# EAGLE design usbDirectController3 (EAGLE 9.4.2)
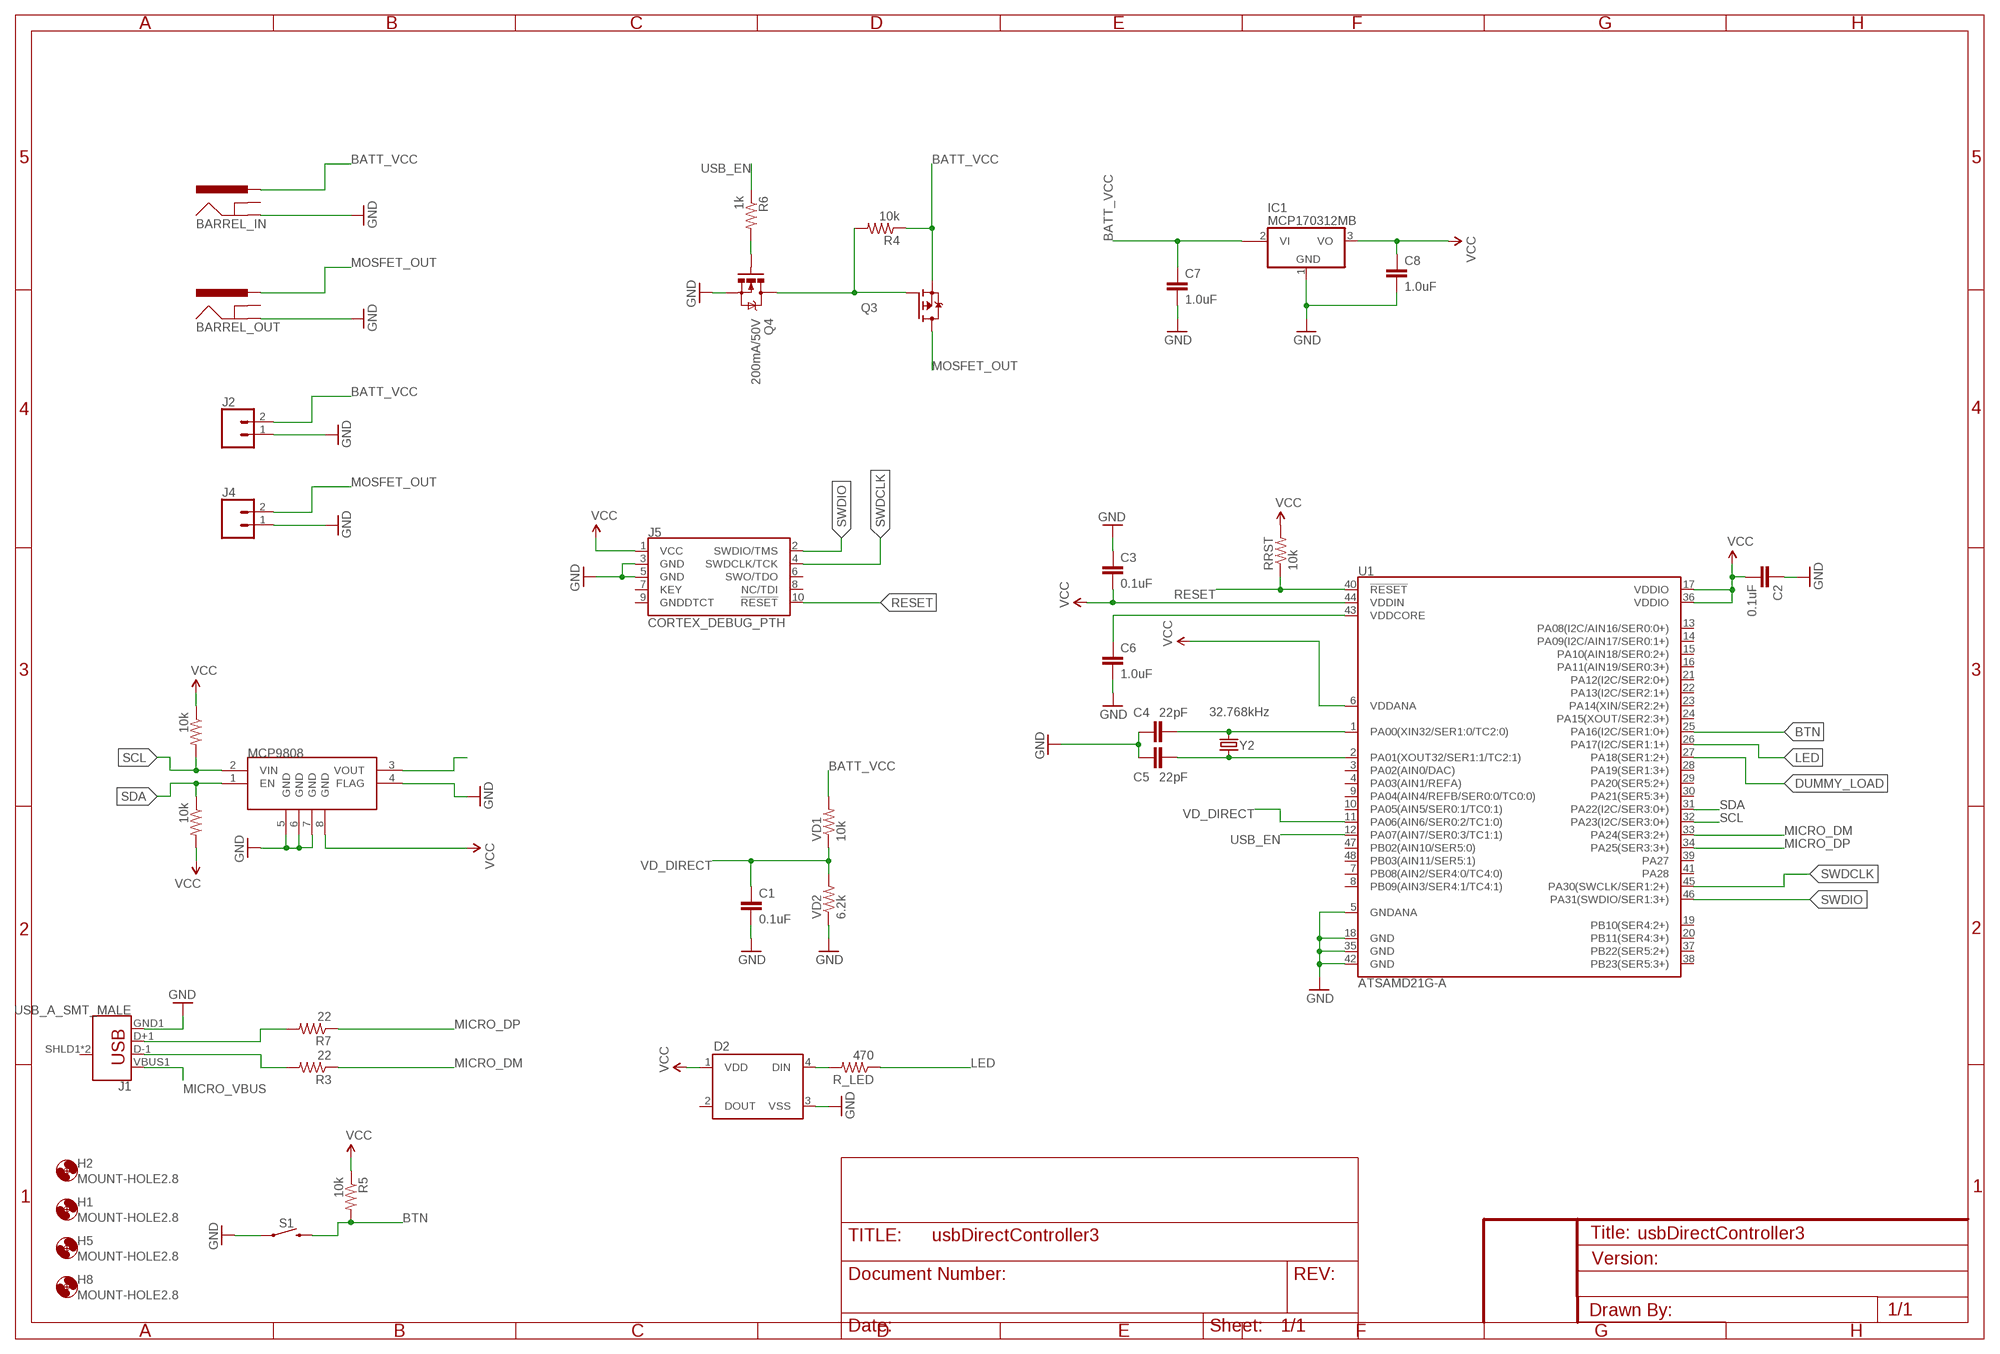
[diagram p0: schematic, sheet 1]

## Parts
BARREL_IN  POWER_JACKPTH_BREAD  [POWER_JACK_PTH_BREAD]
BARREL_OUT  POWER_JACKPTH_BREAD  [POWER_JACK_PTH_BREAD]
C1  0.1uF  CAP0805  [0805]
C2  0.1uF  1.0UF-0805-25V-10%  [0805]
C3  0.1uF  1.0UF-0805-25V-10%  [0805]
C4  22pF  CAP0805  [0805]
C5  22pF  CAP0805  [0805]
C6  1.0uF  1.0UF-0805-25V-10%  [0805]
C7  1.0uF  1.0UF-0805-25V-10%  [0805]
C8  1.0uF  1.0UF-0805-25V-10%  [0805]
D2  WS2812B  [WS2812B]
H1  MOUNT-HOLE2.8  [2,8]
H2  MOUNT-HOLE2.8  [2,8]
H5  MOUNT-HOLE2.8  [2,8]
H8  MOUNT-HOLE2.8  [2,8]
IC1  MCP170312MB  [SOT89]
J1  USB_A_SMT_MALE  [USB-A-SMT-MALE]
J2  CONN_025MM  [SCREWTERMINAL-5MM-2]
J4  CONN_025MM  [SCREWTERMINAL-5MM-2]
J5  CORTEX_DEBUG_PTH  [2X5-PTH-1.27MM]
MCP9808  V_REG_MIC5216  [MSOP8]
Q3  FDD4141TO252  [TO252]
Q4  200mA/50V  MOSFET-NCHANNELBSS138  [SOT23-3]
R3  22  RESISTOR0805-RES  [0805]
R4  10k  RESISTOR0805-RES  [0805]
R5  10k  RESISTOR0805-RES  [0805]
R6  1k  RESISTOR0805-RES  [0805]
R7  22  RESISTOR0805-RES  [0805]
R_I2C_1  10k  RESISTOR0805-RES  [0805]
R_I2C_2  10k  RESISTOR0805-RES  [0805]
R_LED  470  RESISTOR0805-RES  [0805]
RRST  10k  RESISTOR0805-RES  [0805]
S1  MOMENTARY-SWITCH-SPST-SMD-5.2MM  [TACTILE_SWITCH_SMD_5.2MM]
U1  ATSAMD21G-A  [TQFP-48]
VD1  10k  RESISTOR0805-RES  [0805]
VD2  6.2k  RESISTOR0805-RES  [0805]
Y2  32.768kHz  CRYSTAL3.2X1.5MM  [CRYSTAL-SMD-3.2X1.5MM]

## Nets
BATT_VCC: BARREL_IN.PWR C7.1 IC1.2@1(VI1) J2.2 Q3.2(S) R4.1 VD1.2
BTN: R5.2 S1.3 U1.25(PA16(I2C/SER1:0+))
DUMMY_LOAD: U1.27(PA18(SER1:2+))
GND: BARREL_IN.GND BARREL_OUT.GND C1.2 C2.1 C3.1 C4.1 C5.1 C6.2 C7.2 C8.2 D2.3(VSS) IC1.1(GND) J1.GND1(GND) J2.1 J4.1 J5.3(GND) J5.5(GND) MCP9808.4(FLAG) MCP9808.5(GND) MCP9808.6(GND) MCP9808.7(GND) Q4.2(S) S1.1 U1.5(GNDANA) U1.18(GND) U1.35(GND) U1.42(GND) VD2.1
LED: R_LED.1 U1.26(PA17(I2C/SER1:1+))
MICRO_DM: R3.1 U1.33(PA24(SER3:2+))
MICRO_DP: R7.1 U1.34(PA25(SER3:3+))
MICRO_VBUS: J1.VBUS1(VBUS)
MOSFET_OUT [power]: BARREL_OUT.PWR J4.2 Q3.3(D)
N$1: C6.1 U1.43(VDDCORE)
N$2: Q4.1(G) R6.2
N$3: Q3.1(G) Q4.3(D) R4.2
N$4: MCP9808.3(VOUT)
N$5: J1.D+1(D+) R7.2
N$6: J1.D-1(D-) R3.2
N$7: D2.4(DIN) R_LED.2
N$8: C4.2 U1.1(PA00(XIN32/SER1:0/TC2:0)) Y2.P$2
N$32: C5.2 U1.2(PA01(XOUT32/SER1:1/TC2:1)) Y2.P$1
RESET: J5.10(!RESET) RRST.1 U1.40(!RESET!)
SCL: MCP9808.2(VIN) R_I2C_1.2 U1.32(PA23(I2C/SER3:0+))
SDA: MCP9808.1(EN) R_I2C_2.1 U1.31(PA22(I2C/SER3:0+))
SWDCLK: J5.4(SWDCLK/TCK) U1.45(PA30(SWCLK/SER1:2+))
SWDIO: J5.2(SWDIO/TMS) U1.46(PA31(SWDIO/SER1:3+))
USB_EN: R6.1 U1.12(PA07(AIN7/SER0:3/TC1:1))
VCC [power]: C2.2 C3.2 C8.1 D2.1(VDD) IC1.3(VO) J5.1(VCC) MCP9808.8(GND) R5.1 R_I2C_1.1 R_I2C_2.2 RRST.2 U1.6(VDDANA) U1.17(VDDIO) U1.36(VDDIO) U1.44(VDDIN)
VD_DIRECT: C1.1 U1.11(PA06(AIN6/SER0:2/TC1:0)) VD1.1 VD2.2
Unconnected: BARREL_IN.GNDBREAK BARREL_OUT.GNDBREAK D2.2(DOUT) IC1.2(VI) J1.SHLD1(SHIELD) J1.SHLD2(SHIELD) J5.6(SWO/TDO) J5.7(KEY) J5.8(NC/TDI) J5.9(GNDDTCT) U1.3(PA02(AIN0/DAC)) U1.4(PA03(AIN1/REFA)) U1.7(PB08(AIN2/SER4:0/TC4:0)) U1.8(PB09(AIN3/SER4:1/TC4:1)) U1.9(PA04(AIN4/REFB/SER0:0/TC0:0)) U1.10(PA05(AIN5/SER0:1/TC0:1)) U1.13(PA08(I2C/AIN16/SER0:0+)) U1.14(PA09(I2C/AIN17/SER0:1+)) U1.15(PA10(AIN18/SER0:2+)) U1.16(PA11(AIN19/SER0:3+)) U1.19(PB10(SER4:2+)) U1.20(PB11(SER4:3+)) U1.21(PA12(I2C/SER2:0+)) U1.22(PA13(I2C/SER2:1+)) U1.23(PA14(XIN/SER2:2+)) U1.24(PA15(XOUT/SER2:3+)) U1.28(PA19(SER1:3+)) U1.29(PA20(SER5:2+)) U1.30(PA21(SER5:3+)) U1.37(PB22(SER5:2+)) U1.38(PB23(SER5:3+)) U1.39(PA27) U1.41(PA28) U1.47(PB02(AIN10/SER5:0)) U1.48(PB03(AIN11/SER5:1))

## Library data of the parts
BARREL_IN BARREL_OUT = SparkFun-Connectors:POWER_JACK: Power Jack Connector This is the standard 5.5mm barrel jack for power. The PTH is the most common, proven, reliable, footprint. The Slot footprint only works if the mill layer is transmitted to the PCB fab house so be warned. Here are the connectors we sell at SparkFun: DC Barrel Power Jack/Connector <https://www.sparkfun.com/products/119> (PRT-00119) DC Barrel Power Jack/Connector (SMD) <https://www.sparkfun.com/products/12748> (PRT-12748) DC Barrel Jack Adapter - Breadboard Compatible <https://www.sparkfun.com/products/10811> (PRT-10811) It is used on this SparkFun product (and many, many others): SparkFun RedBoard - Programmed with Arduino <https://www.sparkfun.com/products/12757> (DEV-12757) Also, if you need a mating power supply or connector, please check these out: Wall Adapter Power Supply - 9VDC 650mA <https://www.sparkfun.com/products/298> (TOL-00298) DC Barrel Jack Adapter - Male <https://www.sparkfun.com/products/10287> (PRT-10287); PROD_ID: PRT-10811
C1 = SparkFun-Capacitors:CAP: Capacitor Standard 0603 ceramic capacitor, and 0.1" leaded capacitor.
C2 C3 = SparkFun-Capacitors:1.0UF: 1µF ceramic capacitors A capacitor is a passive two-terminal electrical component used to store electrical energy temporarily in an electric field.; PROD_ID: CAP-08064; VALUE: 1.0uF
C4 C5 = SparkFun-Passives:CAP: Capacitor Standard 0603 ceramic capacitor, and 0.1" leaded capacitor.
C6-C8 = SparkFun-Capacitors:1.0UF: 1µF ceramic capacitors A capacitor is a passive two-terminal electrical component used to store electrical energy temporarily in an electric field.; PROD_ID: CAP-08064
D2 = SparkFun-LED:WS2812B: WS2812B - Intelligent control LED integrated light source Technical Specifications: Power Supply Voltage (VDD): 3.5 to 5.3 V Input Voltage (VI): -0.5 to VDD+0.5 V Operating Junction Temperature (Topt): -25°C to +80°C Storage Temperature Range (Tstg): -55°C to +150°C; PROD_ID: DIO-12503
H1 H2 H5 H8 = holes:MOUNT-HOLE: MOUNTING HOLE with drill center marker
IC1 = linear:MCP1703*: 250 mA, 16V, Low Quiescent Current LDO Regulator Source: http://ww1.microchip.com/downloads/en/DeviceDoc/22049b.pdf
J1 = SparkFun-Connectors:USB_A: USB-A Connector Male and female variants, as well as PTH and SMT variants SparkFun Products: SparkFun XBee Explorer Dongle <https://www.sparkfun.com/products/11697> PTH Male SparkFun MicroView-USB Programmer <https://www.sparkfun.com/products/12924> SMT Male SparkFun USB Type A Female Breakout <https://www.sparkfun.com/products/12700> SMT Female; PROD_ID: CONN-11499
J2 J4 = SparkFun-Connectors:CONN_02: Multi connection point. Often used as Generic Header-pin footprint for 0.1 inch spaced/style header connections On any of the 0.1 inch spaced packages, you can populate with these: Break Away Headers - Straight <https://www.sparkfun.com/products/116> (PRT-00116) Break Away Male Headers - Right Angle <https://www.sparkfun.com/products/553> (PRT-00553) Female Headers <https://www.sparkfun.com/products/115> (PRT-00115) Break Away Headers - Machine Pin <https://www.sparkfun.com/products/117> (PRT-00117) Break Away Female Headers - Swiss Machine Pin <https://www.sparkfun.com/products/743> (PRT-00743) For SCREWTERMINALS and SPRING TERMINALS visit here: Screw Terimnals on SparkFun.com <https://www.sparkfun.com/search/results?term=Screw+Terminals> (5mm/3.5mm/2.54mm spacing) This device is also useful as a general connection point to wire up your design to another part of your project. Our various solder wires solder well into these plated through hole pads. Hook-Up Wire - Assortment (Stranded, 22 AWG) <https://www.sparkfun.com/products/11375> (PRT-11375) Hook-Up Wire - Assortment (Solid Core, 22 AWG) <https://www.sparkfun.com/products/11367> (PRT-11367) View the entire wire category on our website here <https://www.sparkfun.com/categories/141> Special notes: Molex polarized connector foot print use with: PRT-08233 with associated crimp pins and housings. 2.54_SCREWTERM for use with PRT-10571. 3.5mm Screw Terminal footprints for PRT-08084 5mm Screw Terminal footprints for use with PRT-08432; SF_SKU: PRT-08432
J5 = SparkFun-Connectors:CORTEX_DEBUG: Cortex Debug Connector - 10 pin Supports JTAG debug, Serial Wire debug, and Serial Wire Viewer. PTH and SMD connector options available. General Connector Information <http://infocenter.arm.com/help/topic/com.arm.doc.faqs/attached/13634/cortex_debug_connectors.pdf> Products: PTH Connector <http://www.digikey.com/product-detail/en/cnc-tech/3220-10-0100-00/1175-1627-ND/3883661> -via Digi-Key SparkFun PSoc <https://www.sparkfun.com/products/13229> SparkFun T <https://www.sparkfun.com/products/13810>
MCP9808 = SparkFun-IC-Power:V_REG_MIC5216: 500mA LDO, MSOP8 for better dissipation; PROD_ID: IC-09527
Q3 = transistor-fet:FDD4141: P-Channel PowerTrench® MOSFET Source: FDD4141.pdf
Q4 = SparkFun-DiscreteSemi:MOSFET-NCHANNEL: Common NMOSFET Parts MFG P/N Store ID Prod ID FDD8780 TRANS-09984 SI7820DN TRANS-11055 FDS6630A IC-08089 2N7002PW TRANS-11151 FQP30N06L COM-10213 TRANS-10060 BSS123LT1G TRANS-08345 BSS138 TRANS-00830 BS170 2N7000; PROD_ID: TRANS-00830
R3 R5 R7 R_I2C_1 R_I2C_2 RRST VD1 VD2 = SparkFun-Passives:RESISTOR: Resistor Basic schematic elements and footprints for 0603, 1206, and PTH resistors.
R4 R6 R_LED = SparkFun-Resistors:RESISTOR: Resistor Basic schematic elements and footprints for 0603, 1206, and PTH resistors.
S1 = SparkFun-Switches:MOMENTARY-SWITCH-SPST: Momentary Switch (Pushbutton) - SPST Normally-open (NO) SPST momentary switches (buttons, pushbuttons). Variants PTH-12MM - 12mm square, through-hole Momentary Pushbutton Switch - 12mm Square <https://www.sparkfun.com/products/9190> (COM-09190) PTH-6.0MM, PTH-6.0MM-KIT - 6.0mm square, through-hole Mini Pushbutton Switch <https://www.sparkfun.com/products/97> (COM-00097) KIT package intended for soldering kit's - only one side of pads' copper is exposed. PTH-RIGHT-ANGLE-KIT - Right-angle, through-hole Right Angle Tactile Button <https://www.sparkfun.com/products/10791> - Used on SparkFun BigTime Watch Kit <https://www.sparkfun.com/products/11734> SMD-12MM - 12mm square, surface-mount Tactile Button - SMD (12mm) <https://www.sparkfun.com/products/12993> (COM-12993) Used on SparkFun PicoBoard <https://www.sparkfun.com/products/11888> SMD-4.5MM - 4.5mm Square Trackball Switch Used on SparkFun Blackberry Trackballer Breakout <https://www.sparkfun.com/products/13169> SMD-4.6MMX2.8MM - 4.60mm x 2.80mm, surface mount Used on SparkFun SAMD21 Mini Breakout <https://www.sparkfun.com/products/13664> SMD-5.2MM, SMD-5.2-REDUNDANT - 5.2mm square, surface-mount Mini Pushbutton Switch - SMD <https://www.sparkfun.com/products/8720> (COM-08720) Used on Arduino Pro Mini <https://www.sparkfun.com/products/11114> REDUNDANT package connects both switch circuits together SMD-6.0X3.5MM - 6.0 x 3.5mm, surface mount Momentary Reset Switch SMD <https://www.sparkfun.com/products/8229> (COM-08229) SMD-6.2MM-TALL - 6.2mm square, surface mount Tactile Button - SMD (6mm) <https://www.sparkfun.com/products/12992> Used on SparkFun Digital Sandbox <https://www.sparkfun.com/products/12651> SMD-RIGHT-ANGLE - Right-angle, surface mount Used on SparkFun Block for Intel® Edison - Arduino <https://www.sparkfun.com/products/13036>; PROD_ID: SWCH-08247; SF_SKU: COM-08720
U1 = SparkFun-IC-Microcontroller:ATSAMD21G: Atmel SAMD21G SMART ARM-Based Microcontroller The Atmel ® | SMART ™ SAM D21 is a series of low-power microcontrollers using the 32-bit ARM ® Cortex ® -M0+ processor, and ranging from 32- to 64-pins with up to 256KB Flash and 32KB of SRAM. The SAM D21 devices operate at a maximum frequency of 48MHz and reach 2.46 CoreMark/MHz. They are designed for simple and intuitive migration with identical peripheral modules, hex compatible code, identical linear address map and pin compatible migration paths between all devices in the product series. All devices include intelligent and flexible peripherals, Atmel Event System for inter-peripheral signaling, and support for capacitive touch button, slider and wheel user interfaces. Datasheet <https://cdn.sparkfun.com/datasheets/Dev/Arduino/Boards/Atmel-42181-SAM-D21_Datasheet.pdf> SparkFun Products SparkFun SAMD21 Mini Breakout <https://www.sparkfun.com/products/13664> (DEV-13664) SparkFun SAMD21 Dev Breakout <https://www.sparkfun.com/products/13672> (DEV-13672); PROD_ID: IC-13064
Y2 = samd21-temp:CRYSTAL: Various standard crystals. Proven footprints.; PROD_ID: XTAL-13062

## Net classes
0 default: width 0.203 mm, clearance 0.152 mm
1 power: width 0.254 mm, clearance 0.203 mm
2 camera_power: width 0.66 mm, clearance 0.254 mm
3 usbsignal: width 0.254 mm, clearance 0.203 mm
4 highpower: clearance 0.305 mm

## Board
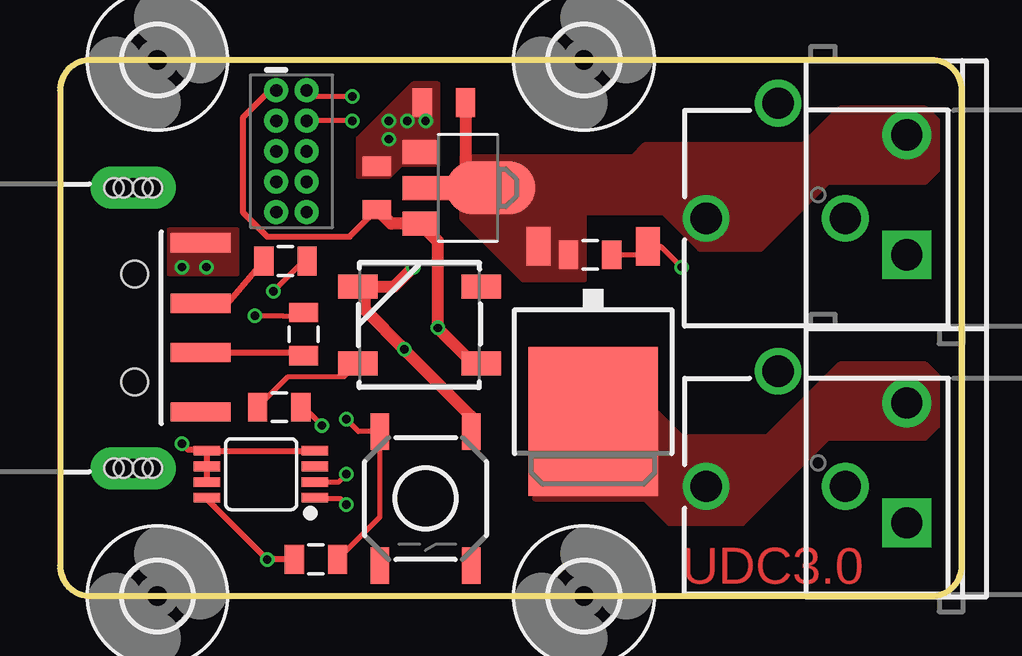
[diagram p1: board, top side]
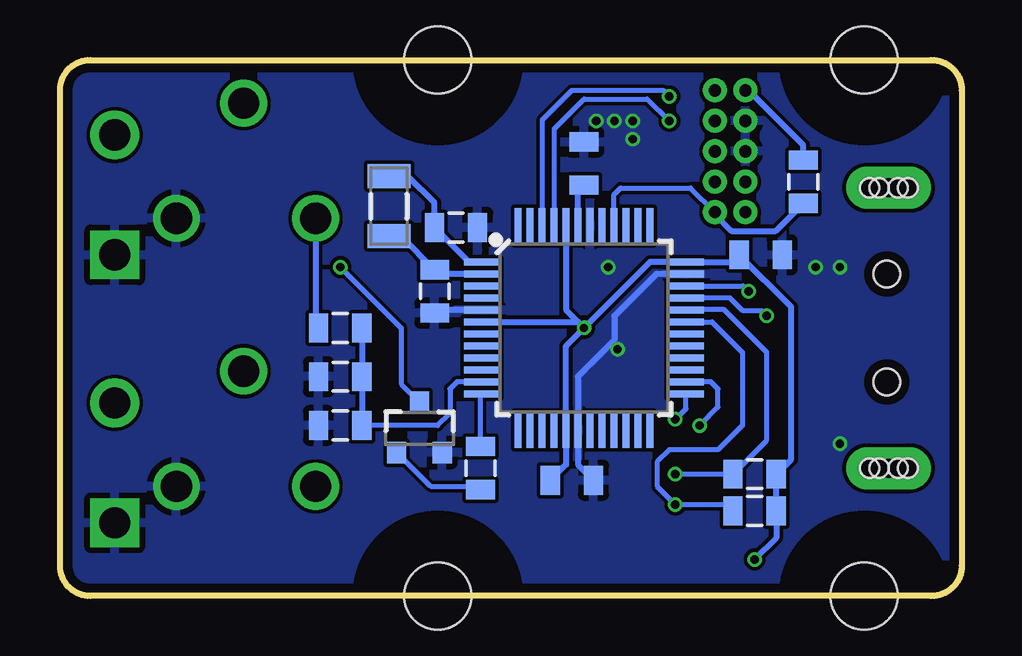
[diagram p2: board, bottom side, seen from below]

Size 37.59 x 22.35 mm. Coordinates in mm from the lower left corner, seen from the top.
Outline: 1.27,0 36.32,0 arc90 37.59,1.27 37.59,21.08 arc90 36.32,22.35 1.27,22.35 arc90 0,21.08 0,1.27 arc90 1.27,0
Copper layers (1*16): Top 0.035559375mm / dielectric 1.6mm / Bottom 0.035559375mm
Design rules "oshpark-2layer": minimum track width 6mil, minimum drill 10mil, track to track 6mil, track to pad 6mil, pad to pad 6mil, via to via 6mil, smd to smd 6mil, copper to edge 15mil, drill to drill 6mil, minimum pad ring 5mil, minimum via ring 5mil, stop-mask expansion 2.5mil, vias tented up to drill 0mil, thermal gap 10mil

### Footprints (pad centres in the part's own frame; a part is rotated, then mirrored left to right if it is on the bottom)
POWER_JACK_PTH_BREAD = drill 1.3: GND 0,7.9; GNDBREAK 4.8,10.7; PWR 0,13.7
0805 = smd 0.8 x 1.2: 1 -0.9,0; 2 0.9,0
WS2812B = smd 1.651 x 1: 1 -2.577,1.6; 2 -2.577,-1.6; 3 2.577,-1.6; 4 2.577,1.6
2,8 = hole 2.8: 0,0
SOT89 = smd 1 x 1.5: 1 -1.499,-1.981; 3 1.499,-1.981 | smd 1 x 2: 2 0,-1.727 | smd 2.2 x 3.7: 2@1 0,0.94
USB-A-SMT-MALE = smd 2.5 x 0.8: D+1 10.95,1.027; D-1 10.95,-1.027; GND1 10.95,3.551; VBUS1 10.95,-3.5 | drill 0.8 pad 1.778 long: SHLD1 8.13,-5.85; SHLD2 8.13,5.85 | hole 1.1: 8.2,2.25; 8.2,-2.25 | hole 0.8: 8.53,-5.85; 8.93,-5.85; 7.73,-5.85; 7.33,-5.85; 8.53,5.85; 8.93,5.85; 7.73,5.85; 7.33,5.85
SCREWTERMINAL-5MM-2 = drill 1.3 pad 2.032 square: 1 0,0 | drill 1.3 pad 2.032: 2 5,0
2X5-PTH-1.27MM = drill 0.508 pad 1: 1 -2.54,-0.635; 2 -2.54,0.635; 3 -1.27,-0.635; 4 -1.27,0.635; 5 0,-0.635; 6 0,0.635; 7 1.27,-0.635; 8 1.27,0.635; 9 2.54,-0.635; 10 2.54,0.635
MSOP8 = smd 0.4 x 1.1: 1 -0.975,-2.25; 2 -0.325,-2.25; 3 0.325,-2.25; 4 0.975,-2.25; 5 0.975,2.25; 6 0.325,2.25; 7 -0.325,2.25; 8 -0.975,2.25
TO252 = smd 1 x 1.6: 1 -2.28,-4.8; 2 2.28,-4.8 | smd 5.4 x 6.2: 3 0,2.5
SOT23-3 = smd 0.8 x 0.9: 1 -0.95,-1; 2 0.95,-1; 3 0,1.1
TACTILE_SWITCH_SMD_5.2MM = smd 1.524 x 0.762: 1 -2.794,1.905; 2 2.794,1.905; 3 -2.794,-1.905; 4 2.794,-1.905
TQFP-48 = smd 1.5 x 0.28: 1 -4.25,2.75; 2 -4.25,2.25; 3 -4.25,1.75; 4 -4.25,1.25; 5 -4.25,0.75; 6 -4.25,0.25; 7 -4.25,-0.25; 8 -4.25,-0.75; 9 -4.25,-1.25; 10 -4.25,-1.75; 11 -4.25,-2.25; 12 -4.25,-2.75; 25 4.25,-2.75; 26 4.25,-2.25; 27 4.25,-1.75; 28 4.25,-1.25; 29 4.25,-0.75; 30 4.25,-0.25; 31 4.25,0.25; 32 4.25,0.75; 33 4.25,1.25; 34 4.25,1.75; 35 4.25,2.25; 36 4.25,2.75 | smd 0.28 x 1.5: 13 -2.75,-4.25; 14 -2.25,-4.25; 15 -1.75,-4.25; 16 -1.25,-4.25; 17 -0.75,-4.25; 18 -0.25,-4.25; 19 0.25,-4.25; 20 0.75,-4.25; 21 1.25,-4.25; 22 1.75,-4.25; 23 2.25,-4.25; 24 2.75,-4.25; 37 2.75,4.25; 38 2.25,4.25; 39 1.75,4.25; 40 1.25,4.25; 41 0.75,4.25; 42 0.25,4.25; 43 -0.25,4.25; 44 -0.75,4.25; 45 -1.25,4.25; 46 -1.75,4.25; 47 -2.25,4.25; 48 -2.75,4.25
CRYSTAL-SMD-3.2X1.5MM = smd 1 x 1.8: P$1 -1.25,0; P$2 1.25,0

### Placement (x,y rotation side)
BARREL_IN  40.64,15.75 90 top
BARREL_OUT  40.64,4.57 90 top
C1  25.91,7.11 180 bottom
C2  8.38,14.22 180 bottom
C3  16.26,4.83 180 bottom
C4  21.08,15.37 180 bottom
C5  21.97,12.7 90 bottom
C6  15.75,18.03 90 bottom
C7  16,20.57 180 top
C8  13.21,17.02 90 top
D2  14.99,11.3 180 top
H1  21.84,0 0 top
H2  21.84,22.35 0 top
H5  4.06,0 0 top
H8  4.06,22.35 0 top
IC1  17.02,17.02 270 top
J1  -5.08,11.18 0 top
J2  35.31,14.22 90 top
J4  35.31,3.05 90 top
J5  9.65,18.54 270 top
MCP9808  8.38,5.08 90 top
Q3  22.23,9.78 180 top
Q4  22.61,6.99 0 bottom
R3  10.16,10.92 270 top
R4  22.1,14.22 0 top
R5  10.67,1.52 0 top
R6  20.07,5.33 270 bottom
R7  9.4,13.97 180 top
R_I2C_1  8.64,5.08 180 bottom
R_I2C_2  8.64,3.56 0 bottom
R_LED  9.14,7.87 180 top
RRST  6.6,17.27 90 bottom
S1  15.24,4.06 270 top
U1  15.75,11.18 0 bottom
VD1  25.91,11.18 180 bottom
VD2  25.91,9.14 0 bottom
Y2  23.88,16.26 90 bottom

### Tracks (layer width: path | path; a pad name or v marks a point on that pad's centre or on a via)
BATT_VCC
  Top 0.508: C7.1 16.9,17.64 17.53,17.02 IC1.2@1
  Bottom 0.254: BARREL_IN.PWR 26.94,11.31 VD1.2
  pour Top (no thermals): 36.07,20.32 32.51,20.32 30.99,18.8 24.38,18.8 23.88,18.29 16.76,18.29 16.76,15.75 19.3,13.21 21.84,13.21 21.84,16 25.15,16 26.67,14.48 29.21,14.48 32,17.27 36.07,17.27 36.58,17.78 36.58,19.81
BTN  (via drill 0.35)
  Top 0.203: R5.2 13.34,3.29 S1.3 12.45,6.86 v11.94,7.37
  Bottom 0.203: v11.94,7.37 11.5,7.81 U1.25
GND  (via drill 0.35)
  Top 0.254: MCP9808.7 MCP9808.6 MCP9808.5 | MCP9808.5 MCP9808.4 | MCP9808.5 6.09,6.1 5.33,6.1 v5.08,6.35
  Top 0.508: 15.1,18.58 IC1.1 | S1.1 17.14,7.49 v14.35,10.29 12.7,11.94 12.7,12.61 D2.3 13.92,12.9 v14.73,13.72
  Bottom 0.254: U1.5 21.84,11.93 C5.1 | C3.1 16,5.47 U1.18 16,9.14 14.48,10.67 14.48,11.68 12.74,13.43 U1.35
  other vias: 5.08,13.72 6.1,13.72 14.48,19.81 13.72,19.81 15.24,19.81 13.72,19.05
  pour Bottom (rank 2): 0,0 37.59,0 37.59,22.35 0,22.35
  pour Top (no thermals): 4.57,15.24 4.57,13.46 7.37,13.46 7.37,15.24
  pour Top (no thermals): 15.75,21.34 14.73,21.34 12.45,19.05 12.45,17.53 13.72,17.53 14.22,18.03 15.75,18.03
LED  (via drill 0.35)
  Top 0.203: R_LED.1 10.3,7.74 v10.92,7.11
  Bottom 0.203: v10.92,7.11 10.16,7.87 10.16,8.64 10.45,8.93 U1.26
MICRO_DM  (via drill 0.35)
  Top 0.203: v8.13,11.68 9.14,11.68 9.28,11.68 10.02,11.68 R3.1
  Bottom 0.203: U1.33 9.66,12.43 9.12,11.89 8.33,11.89 v8.13,11.68
MICRO_DP  (via drill 0.35)
  Top 0.203: R7.1 10.16,13.97 v8.89,12.7
  Bottom 0.203: U1.34 9.12,12.93 v8.89,12.7
MOSFET_OUT
  pour Top (no thermals): 19.81,4.06 24.38,4.06 25.4,3.05 28.45,3.05 32,6.6 36.07,6.6 36.58,7.11 36.58,9.14 36.07,9.65 32.51,9.65 29.46,6.6 25.91,6.6 24.38,8.13 24.38,9.65 19.81,9.65
N$1
  Bottom 0.254: U1.43 16,17.16 C6.1
N$2
  Bottom 0.203: Q4.1 22.14,4.57 20.2,4.57 R6.2
N$3  (via drill 0.35)
  Top 0.203: R4.2 24.15,14.22 Q3.1 25.05,14.58 v25.91,13.72
  Bottom 0.203: Q4.3 23.37,8.85 23.37,11.18 v25.91,13.72
N$5
  Top 0.254: J1.D+1 6.99,12.2 R7.2
N$6
  Top 0.254: J1.D-1 9.5,10.15 10.07,10.12 R3.2
N$7
  Top 0.203: R_LED.2 9.51,9.14 11.85,9.14 D2.4
N$8
  Bottom 0.254: U1.1 20.54,13.93 C4.2 21.98,16.39 23.09,17.51 Y2.P$2
N$32
  Bottom 0.254: U1.2 21.8,13.43 C5.2 23.38,15.01 Y2.P$1
RESET
  Bottom 0.203: U1.40 14.5,16.74 14.22,17.02 11.3,17.02 J5.10
  Bottom 0.254: J5.10 10.29,15.92 9.59,15.22 7.75,15.22 RRST.1
SCL  (via drill 0.35)
  Top 0.203: MCP9808.2 11.61,4.75 v11.94,5.08
  Bottom 0.203: U1.32 11.49,11.94 9.91,11.94 8.13,10.16 8.13,6.49 R_I2C_1.2 v11.94,5.08
SDA  (via drill 0.35)
  Top 0.203: MCP9808.1 10.67,4.06 11.68,4.06 v11.94,3.81
  Bottom 0.203: U1.31 10.41,11.43 9.14,10.16 9.14,7.11 10.16,6.1 12.19,6.1 12.7,5.59 12.7,4.57 v11.94,3.81 9.79,3.81 R_I2C_2.1
SWDCLK  (via drill 0.35)
  Top 0.203: v12.19,19.81 J5.4
  Bottom 0.203: U1.45 17,19.48 15.75,20.73 13.11,20.73 v12.19,19.81
SWDIO  (via drill 0.35)
  Top 0.203: v12.19,20.83 10.54,20.83 J5.2
  Bottom 0.203: U1.46 17.5,19.84 16.26,21.08 12.45,21.08 v12.19,20.83
USB_EN
  Bottom 0.203: R6.1 20.07,8.36 U1.12
VCC  (via drill 0.35)
  Top 0.254: J5.1 8.76,21.08 7.62,19.94 7.62,16 8.64,14.99 12.08,14.99 C8.1 | MCP9808.8 6.13,4.03 v8.64,1.52 R5.1
  Top 0.508: C8.1 13.81,15.52 IC1.3 15.75,14.81 v15.75,11.18 17.22,9.7 D2.1
  Bottom 0.254: C3.2 16.5,5.48 U1.17 16.5,10.43 v15.75,11.18 | U1.6 16,11.43 v15.75,11.18 | v15.75,11.18 13,13.93 U1.36 9.58,13.93 C2.2 7.11,12.05 7.11,5.7 R_I2C_1.1 R_I2C_2.2 7.74,2.42 v8.64,1.52 | RRST.2 6.6,18.8 8.89,21.08 J5.1 | U1.44 16.5,11.93 v15.75,11.18
VD_DIRECT
  Bottom 0.203: U1.11 21.05,8.93 21.34,8.64 21.34,7.62 21.84,7.11 C1.1
  Bottom 0.254: VD1.1 VD2.2 C1.1

### Text on the board
Top: UDC3.0